# EAGLE board csa_copro-v1.0b (EAGLE 4.15), part 1 of 2
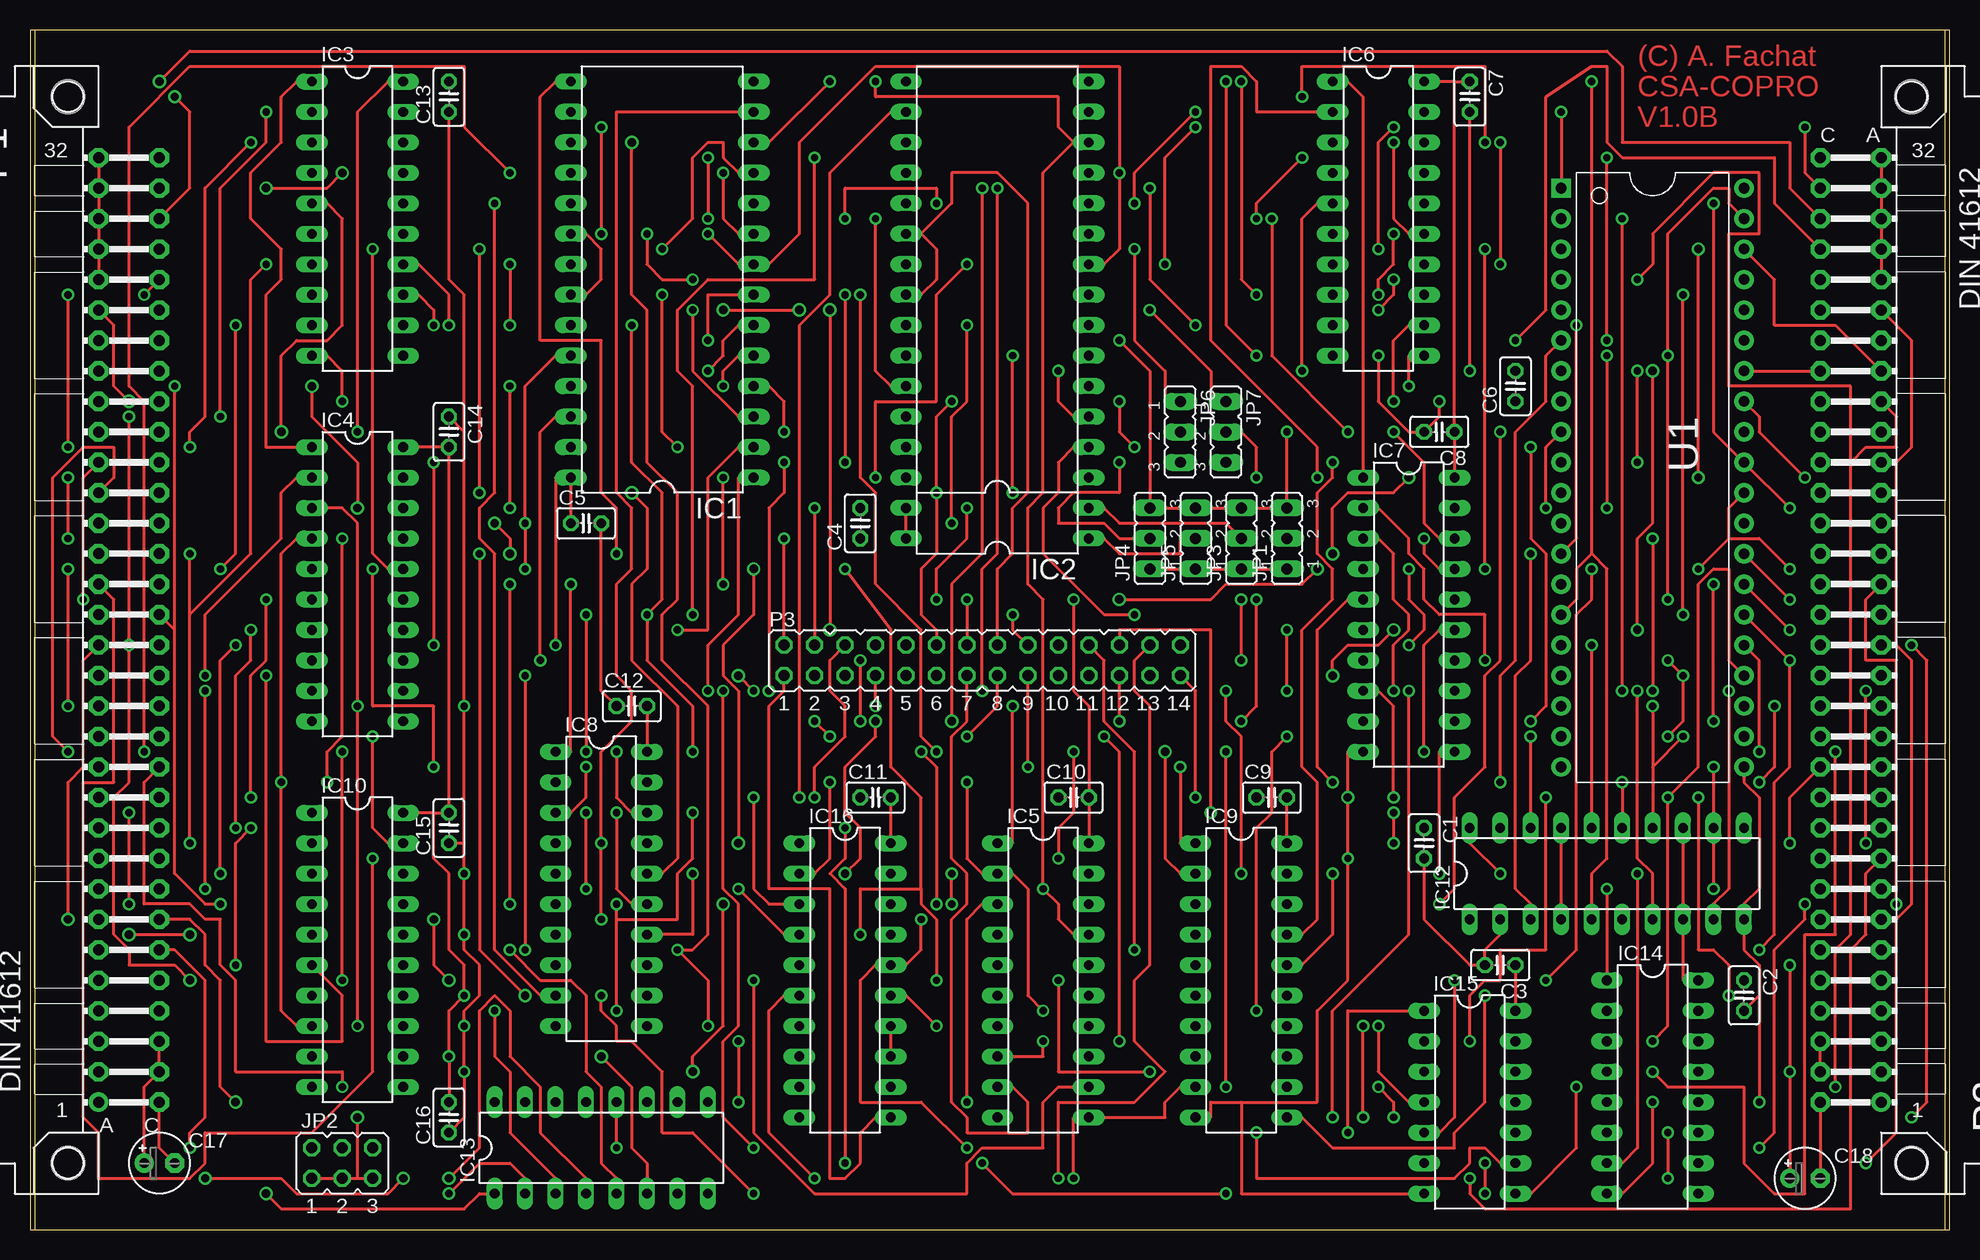
[diagram p1: board, top side]
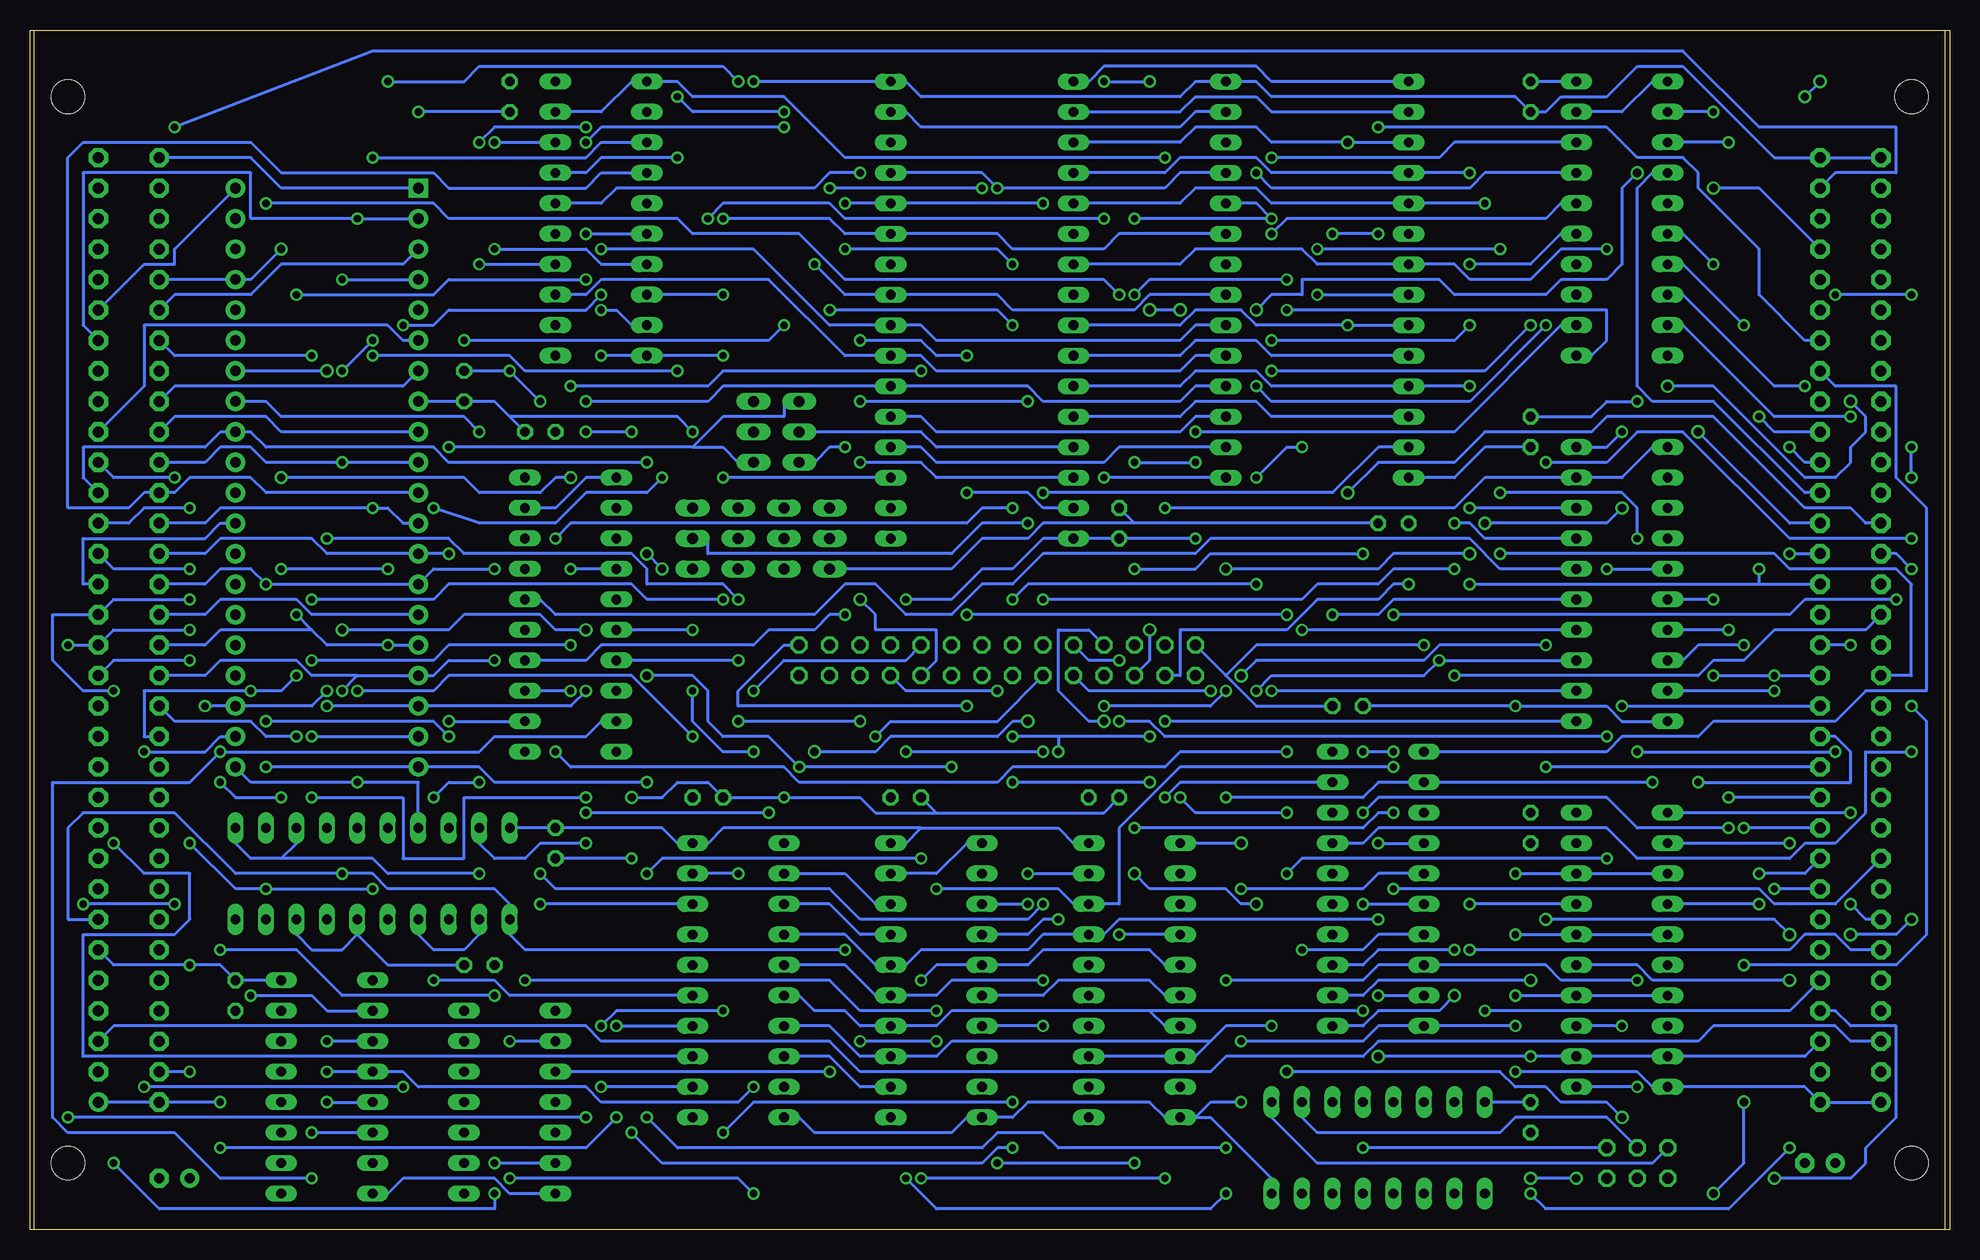
[diagram p2: board, bottom side, seen from below]

Size 160 x 100.03 mm. Coordinates in mm from the lower left corner, seen from the top.
Outline: 0,0.01 160,0.01 160,100.01 0,100.01 0,0.01
Copper layers (1*16): Top 0.035mm / dielectric 1.5mm / Bottom 0.035mm
Design rules "default": minimum track width 10mil, minimum drill 24mil, track to track 8mil, track to pad 8mil, pad to pad 8mil, via to via 8mil, smd to smd 8mil, copper to edge 40mil, drill to drill 8mil, minimum pad ring 10mil, minimum via ring 8mil, stop-mask expansion 4mil, vias tented up to drill 0mil, thermal gap 10mil

## Footprints (pad centres in the part's own frame; a part is rotated, then mirrored left to right if it is on the bottom)
C025-025X050 = drill 0.813 octagon: 1 -1.27,0; 2 1.27,0
E2,5-5 = drill 0.813 pad 1.6 round: + -1.27,0 | drill 0.813 pad 1.6 octagon: - 1.27,0
DIL28 = drill 0.813 long: 1 -13.97,-7.62; 2 -11.43,-7.62; 3 -8.89,-7.62; 4 -6.35,-7.62; 5 -3.81,-7.62; 6 -1.27,-7.62; 7 1.27,-7.62; 8 3.81,-7.62; 9 6.35,-7.62; 10 8.89,-7.62; 11 11.43,-7.62; 12 13.97,-7.62; 13 16.51,-7.62; 14 19.05,-7.62; 15 19.05,7.62; 16 16.51,7.62; 17 13.97,7.62; 18 11.43,7.62; 19 8.89,7.62; 20 6.35,7.62; 21 3.81,7.62; 22 1.27,7.62; 23 -1.27,7.62; 24 -3.81,7.62; 25 -6.35,7.62; 26 -8.89,7.62; 27 -11.43,7.62; 28 -13.97,7.62
DIL32OPT28 = drill 0.813 long: 1 -19.05,-7.62; 2 -16.51,-7.62; 3 -13.97,-7.62; 4 -11.43,-7.62; 5 -8.89,-7.62; 6 -6.35,-7.62; 7 -3.81,-7.62; 8 -1.27,-7.62; 9 1.27,-7.62; 10 3.81,-7.62; 11 6.35,-7.62; 12 8.89,-7.62; 13 11.43,-7.62; 14 13.97,-7.62; 15 16.51,-7.62; 16 19.05,-7.62; 17 19.05,7.62; 18 16.51,7.62; 19 13.97,7.62; 20 11.43,7.62; 21 8.89,7.62; 22 6.35,7.62; 23 3.81,7.62; 24 1.27,7.62; 25 -1.27,7.62; 26 -3.81,7.62; 27 -6.35,7.62; 28 -8.89,7.62; 29 -11.43,7.62; 30 -13.97,7.62; 31 -16.51,7.62; 32 -19.05,7.62
DIL20 = drill 0.813 long: 1 -11.43,-3.81; 2 -8.89,-3.81; 3 -6.35,-3.81; 4 -3.81,-3.81; 5 -1.27,-3.81; 6 1.27,-3.81; 7 3.81,-3.81; 8 6.35,-3.81; 9 8.89,-3.81; 10 11.43,-3.81; 11 11.43,3.81; 12 8.89,3.81; 13 6.35,3.81; 14 3.81,3.81; 15 1.27,3.81; 16 -1.27,3.81; 17 -3.81,3.81; 18 -6.35,3.81; 19 -8.89,3.81; 20 -11.43,3.81
DIL20' = drill 0.813 long: 1 -10.16,-3.81; 2 -7.62,-3.81; 3 -5.08,-3.81; 4 -2.54,-3.81; 5 0,-3.81; 6 2.54,-3.81; 7 5.08,-3.81; 8 7.62,-3.81; 9 10.16,-3.81; 10 12.7,-3.81; 11 12.7,3.81; 12 10.16,3.81; 13 7.62,3.81; 14 5.08,3.81; 15 2.54,3.81; 16 0,3.81; 17 -2.54,3.81; 18 -5.08,3.81; 19 -7.62,3.81; 20 -10.16,3.81
DIL16 = drill 0.813 long: 1 -8.89,-3.81; 2 -6.35,-3.81; 3 -3.81,-3.81; 4 -1.27,-3.81; 5 1.27,-3.81; 6 3.81,-3.81; 7 6.35,-3.81; 8 8.89,-3.81; 9 8.89,3.81; 10 6.35,3.81; 11 3.81,3.81; 12 1.27,3.81; 13 -1.27,3.81; 14 -3.81,3.81; 15 -6.35,3.81; 16 -8.89,3.81
DIL14 = drill 0.813 long: 1 -7.62,-3.81; 2 -5.08,-3.81; 3 -2.54,-3.81; 4 0,-3.81; 5 2.54,-3.81; 6 5.08,-3.81; 7 7.62,-3.81; 8 7.62,3.81; 9 5.08,3.81; 10 2.54,3.81; 11 0,3.81; 12 -2.54,3.81; 13 -5.08,3.81; 14 -7.62,3.81
JP2 = drill 0.914 long: 1 -2.54,0; 2 0,0; 3 2.54,0
JP3Q = drill 0.914 octagon: 1 -2.54,-1.27; 2 -2.54,1.27; 3 0,-1.27; 4 0,1.27; 5 2.54,-1.27; 6 2.54,1.27
CSABUS = drill 0.914 pad 1.6 round: A1 7.62,36.83 | drill 0.914 pad 1.6 octagon: A2 7.62,34.29; A3 7.62,31.75; A4 7.62,29.21; A5 7.62,26.67; A6 7.62,24.13; A7 7.62,21.59; A8 7.62,19.05; A9 7.62,16.51; A10 7.62,13.97; A11 7.62,11.43; A12 7.62,8.89; A13 7.62,6.35; A14 7.62,3.81; A15 7.62,1.27; A16 7.62,-1.27; A17 7.62,-3.81; A18 7.62,-6.35; A19 7.62,-8.89; A20 7.62,-11.43; A21 7.62,-13.97; A22 7.62,-16.51; A23 7.62,-19.05; A24 7.62,-21.59; A25 7.62,-24.13; A26 7.62,-26.67; A27 7.62,-29.21; A28 7.62,-31.75; A29 7.62,-34.29; A30 7.62,-36.83; A31 7.62,-39.37; A32 7.62,-41.91; C1 2.54,36.83; C2 2.54,34.29; C3 2.54,31.75; C4 2.54,29.21; C5 2.54,26.67; C6 2.54,24.13; C7 2.54,21.59; C8 2.54,19.05; C9 2.54,16.51; C10 2.54,13.97; C11 2.54,11.43; C12 2.54,8.89; C13 2.54,6.35; C14 2.54,3.81; C15 2.54,1.27; C16 2.54,-1.27; C17 2.54,-3.81; C18 2.54,-6.35; C19 2.54,-8.89; C20 2.54,-11.43; C21 2.54,-13.97; C22 2.54,-16.51; C23 2.54,-19.05; C24 2.54,-21.59; C25 2.54,-24.13; C26 2.54,-26.67; C27 2.54,-29.21; C28 2.54,-31.75; C29 2.54,-34.29; C30 2.54,-36.83; C31 2.54,-39.37; C32 2.54,-41.91 | hole 2.794: 10.16,41.91; 10.16,-46.99
CSABUSSOCK = drill 0.914 pad 1.6 round: A1 -7.62,-39.37 | drill 0.914 pad 1.6 octagon: A2 -7.62,-36.83; A3 -7.62,-34.29; A4 -7.62,-31.75; A5 -7.62,-29.21; A6 -7.62,-26.67; A7 -7.62,-24.13; A8 -7.62,-21.59; A9 -7.62,-19.05; A10 -7.62,-16.51; A11 -7.62,-13.97; A12 -7.62,-11.43; A13 -7.62,-8.89; A14 -7.62,-6.35; A15 -7.62,-3.81; A16 -7.62,-1.27; A17 -7.62,1.27; A18 -7.62,3.81; A19 -7.62,6.35; A20 -7.62,8.89; A21 -7.62,11.43; A22 -7.62,13.97; A23 -7.62,16.51; A24 -7.62,19.05; A25 -7.62,21.59; A26 -7.62,24.13; A27 -7.62,26.67; A28 -7.62,29.21; A29 -7.62,31.75; A30 -7.62,34.29; A31 -7.62,36.83; A32 -7.62,39.37; C1 -12.7,-39.37; C2 -12.7,-36.83; C3 -12.7,-34.29; C4 -12.7,-31.75; C5 -12.7,-29.21; C6 -12.7,-26.67; C7 -12.7,-24.13; C8 -12.7,-21.59; C9 -12.7,-19.05; C10 -12.7,-16.51; C11 -12.7,-13.97; C12 -12.7,-11.43; C13 -12.7,-8.89; C14 -12.7,-6.35; C15 -12.7,-3.81; C16 -12.7,-1.27; C17 -12.7,1.27; C18 -12.7,3.81; C19 -12.7,6.35; C20 -12.7,8.89; C21 -12.7,11.43; C22 -12.7,13.97; C23 -12.7,16.51; C24 -12.7,19.05; C25 -12.7,21.59; C26 -12.7,24.13; C27 -12.7,26.67; C28 -12.7,29.21; C29 -12.7,31.75; C30 -12.7,34.29; C31 -12.7,36.83; C32 -12.7,39.37 | hole 2.794: -5.08,44.45; -5.08,-44.45
FLAT28 = drill 0.914 octagon: 1 -15.24,-1.27; 2 -12.7,-1.27; 3 -10.16,-1.27; 4 -7.62,-1.27; 5 -5.08,-1.27; 6 -2.54,-1.27; 7 0,-1.27; 8 2.54,-1.27; 9 5.08,-1.27; 10 7.62,-1.27; 11 10.16,-1.27; 12 12.7,-1.27; 13 15.24,-1.27; 14 17.78,-1.27; A -15.24,1.27; B -12.7,1.27; C -10.16,1.27; D -7.62,1.27; E -5.08,1.27; F -2.54,1.27; H 0,1.27; J 2.54,1.27; K 5.08,1.27; L 7.62,1.27; M 10.16,1.27; N 12.7,1.27; P 15.24,1.27; Q 17.78,1.27
DIP-40 = drill 0.889 pad 1.6 square: 1 -22.86,-7.62 | drill 0.889 pad 1.6 round: 2 -20.32,-7.62; 3 -17.78,-7.62; 4 -15.24,-7.62; 5 -12.7,-7.62; 6 -10.16,-7.62; 7 -7.62,-7.62; 8 -5.08,-7.62; 9 -2.54,-7.62; 10 0,-7.62; 11 2.54,-7.62; 12 5.08,-7.62; 13 7.62,-7.62; 14 10.16,-7.62; 15 12.7,-7.62; 16 15.24,-7.62; 17 17.78,-7.62; 18 20.32,-7.62; 19 22.86,-7.62; 20 25.4,-7.62; 21 25.4,7.62; 22 22.86,7.62; 23 20.32,7.62; 24 17.78,7.62; 25 15.24,7.62; 26 12.7,7.62; 27 10.16,7.62; 28 7.62,7.62; 29 5.08,7.62; 30 2.54,7.62; 31 0,7.62; 32 -2.54,7.62; 33 -5.08,7.62; 34 -7.62,7.62; 35 -10.16,7.62; 36 -12.7,7.62; 37 -15.24,7.62; 38 -17.78,7.62; 39 -20.32,7.62; 40 -22.86,7.62

## Placement (x,y rotation side)
C1  100n  [C025-025X050]  116.2,32.23 270 top
C2  100n  [C025-025X050]  142.87,19.53 270 top
C3  100n  [C025-025X050]  122.55,22.07 180 top
C4  100n  [C025-025X050]  69.21,58.9 90 top
C5  100n  [C025-025X050]  46.35,58.9 0 top
C6  100n  [C025-025X050]  123.82,70.33 90 top
C7  100n  [C025-025X050]  120.01,94.46 270 top
C8  100n  [C025-025X050]  117.47,66.52 180 top
C9  100n  [C025-025X050]  103.5,36.04 0 top
C10  100n  [C025-025X050]  86.99,36.04 0 top
C11  100n  [C025-025X050]  70.48,36.04 0 top
C12  100n  [C025-025X050]  50.16,43.66 0 top
C13  100n  [C025-025X050]  34.92,94.46 90 top
C14  100n  [C025-025X050]  34.92,66.52 270 top
C15  100n  [C025-025X050]  34.92,33.5 90 top
C16  100n  [C025-025X050]  34.92,9.37 90 top
C17  47u  [E2,5-5]  10.79,5.56 0 top
C18  47u  [E2,5-5]  147.95,4.29 0 top
IC1  RAMSOCKET8OR32K  [DIL28]  52.7,76.68 90 top
IC2  ROMSOCK32TO512K  [DIL32OPT28]  80.64,76.68 90 top
IC3  74HCT541N  [DIL20]  27.3,84.3 270 top
IC4  74HCT541N  [DIL20]  27.3,53.82 270 top
IC5  74HCT541N  [DIL20]  84.45,20.8 270 top
IC6  74HCT541N  [DIL20]  112.39,84.3 270 top
IC7  74HCT541N  [DIL20]  114.93,51.28 270 top
IC8  74HCT245N  [DIL20]  47.62,28.42 270 top
IC9  74HCT245N  [DIL20]  100.96,20.8 270 top
IC10  74LS688BUSOPT  [DIL20']  27.3,24.61 270 top
IC12  74LS688BUSOPT  [DIL20']  130.17,29.69 0 top
IC13  74HCT138N  [DIL16]  47.62,6.83 0 top
IC14  74HCT138N  [DIL16]  135.25,11.91 270 top
IC15  74LS07N  [DIL14]  120.01,10.64 270 top
IC16  74LS273BUSOPT  [DIL20']  67.94,22.07 270 top
JP1  [JP2]  104.77,57.63 90 top
JP2  [JP3Q]  26.03,5.56 0 top
JP3  [JP2]  100.96,57.63 90 top
JP4  [JP2]  93.34,57.63 90 top
JP5  [JP2]  97.15,57.63 90 top
JP6  [JP2]  95.88,66.52 270 top
JP7  [JP2]  99.69,66.52 270 top
P1  CSABUS  [CSABUS]  13.33,47.47 180 top
P2  CSABUSSOCKET  [CSABUSSOCK]  161.92,50.01 0 top
P3  CSA_COPRO_ADDON  [FLAT28]  78.1,47.47 0 top
U1  [DIP-40]  135.25,63.98 270 top